# Altium project Beam_BMS_light.PrjPcb
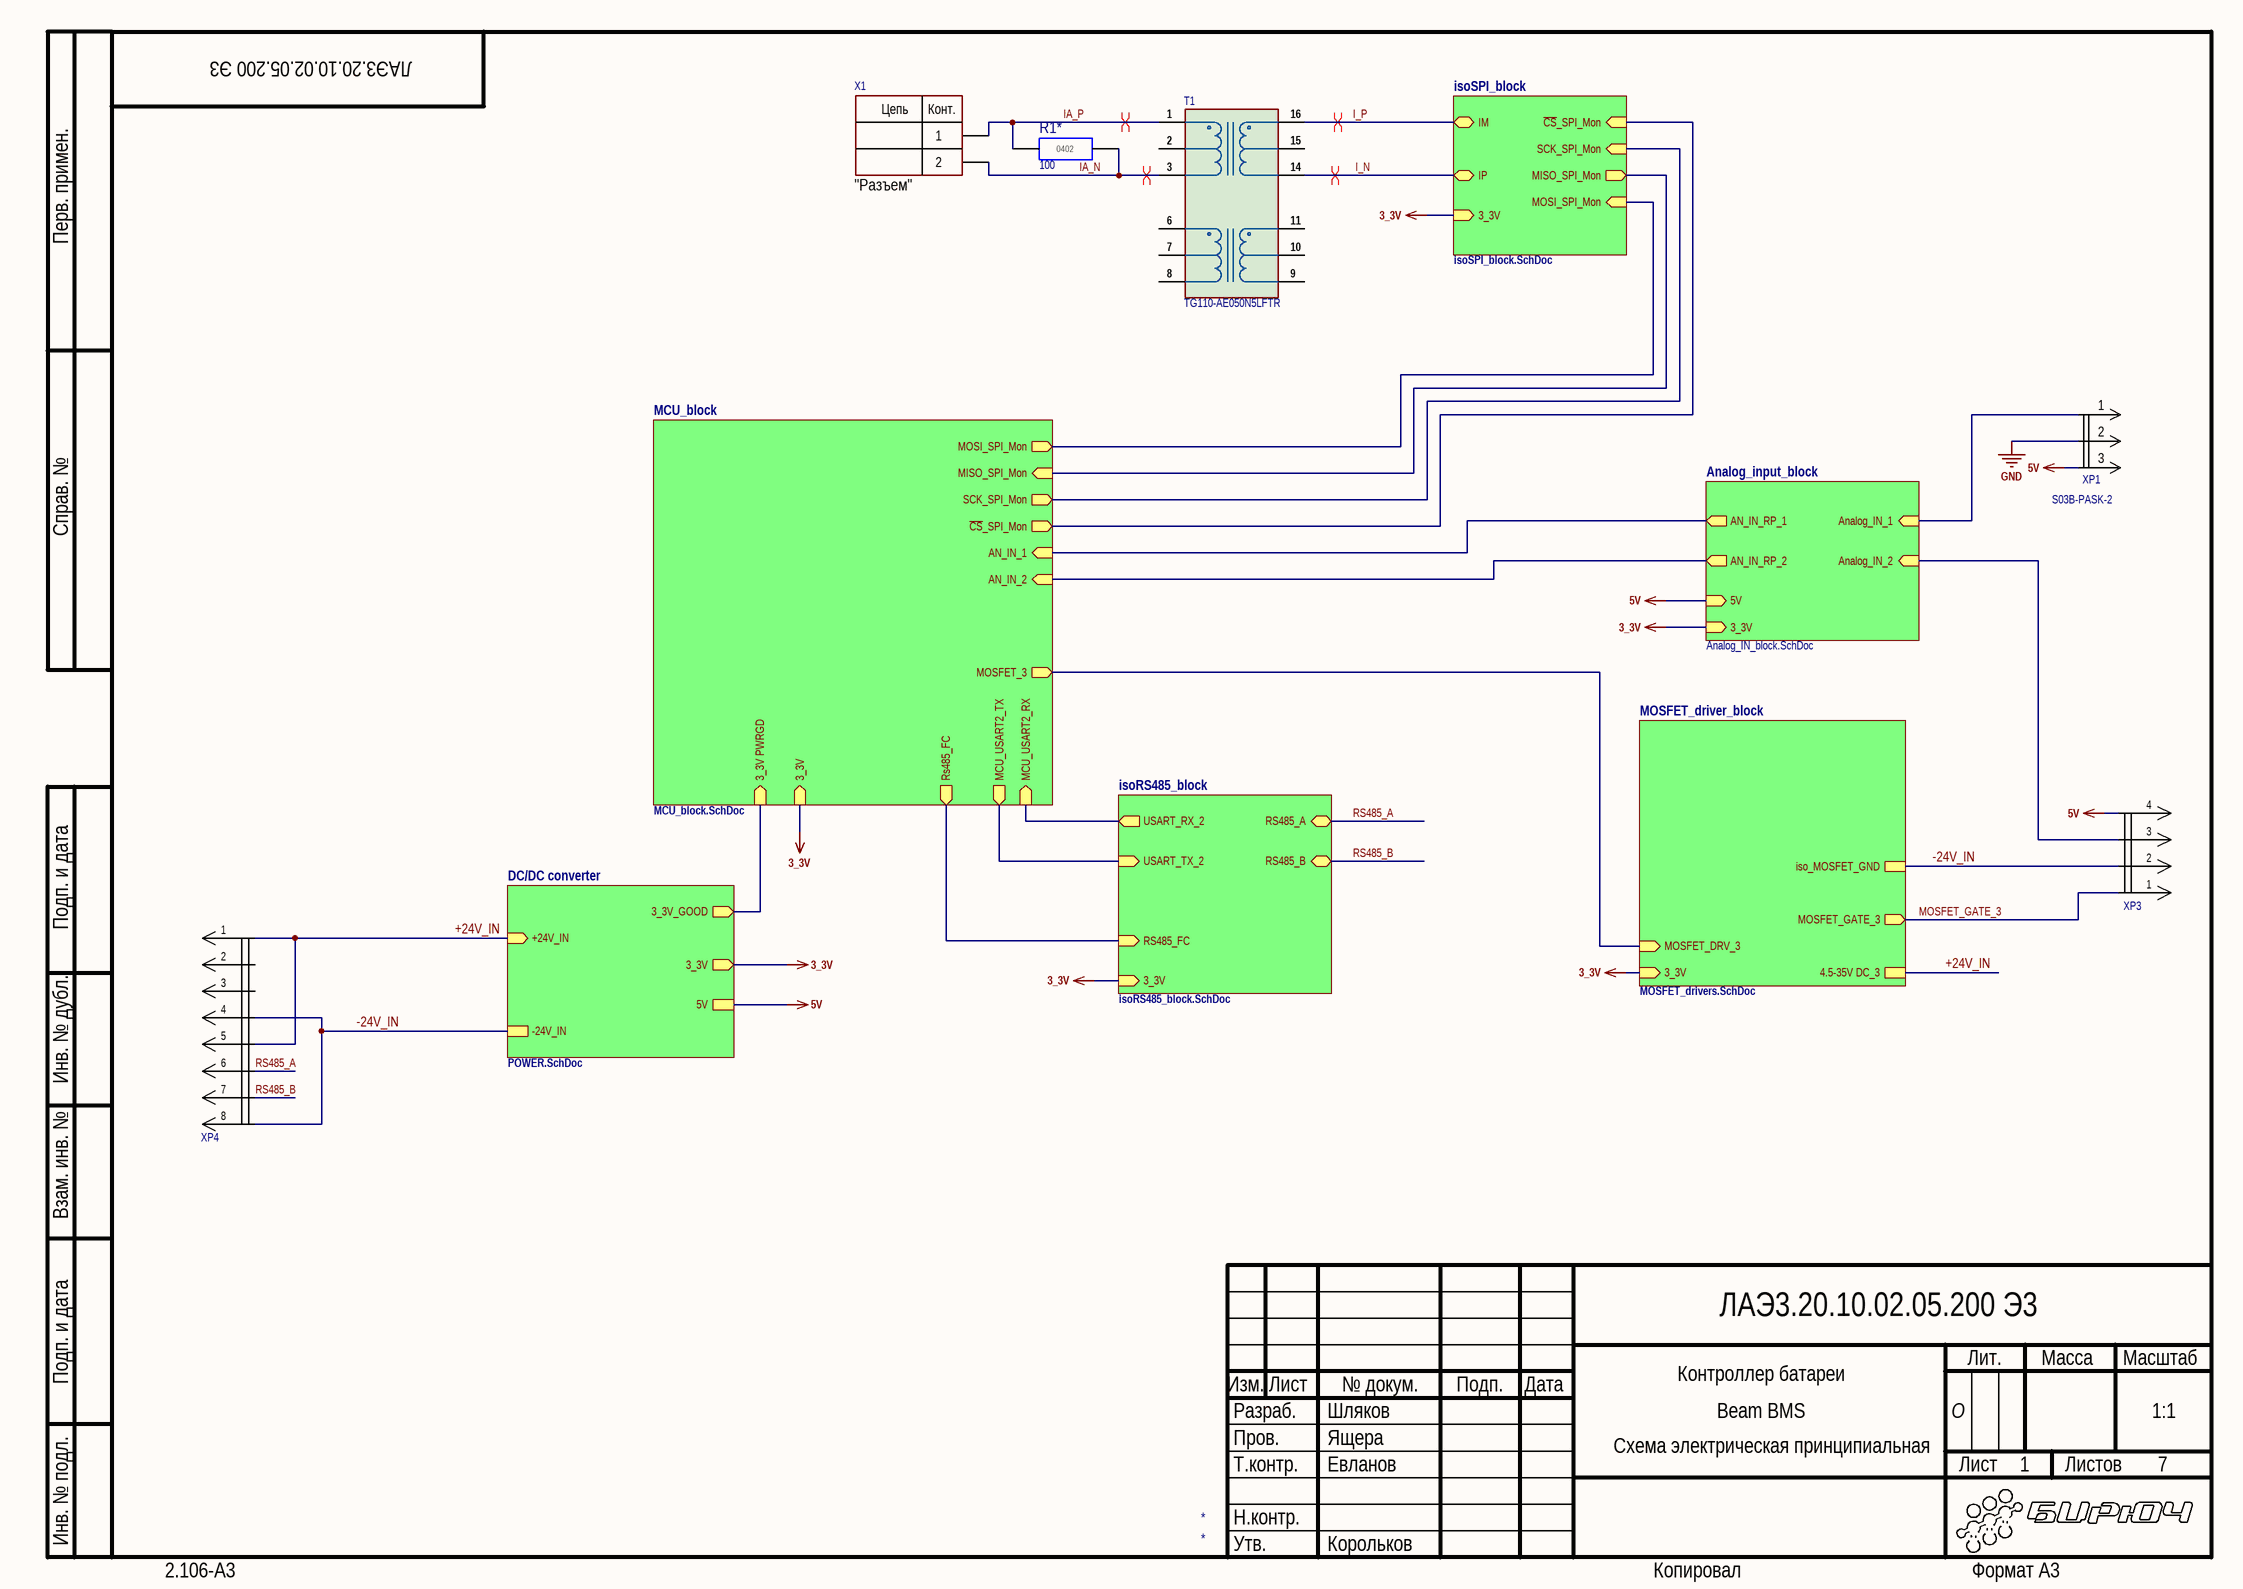
[diagram p0: Main.SchDoc]
7 sheets, 129 parts. Net scope: hierarchical (ports join the sheet entries above them; power ports are global).
Board file: Beam_BMS_light.PcbDoc
Sheets:
  Main.SchDoc
    isoSPI_block = isoSPI_block.SchDoc
    DC/DC converter = POWER.SchDoc
    MCU_block = MCU_block.SchDoc
    isoRS485_block = isoRS485_block.SchDoc
    MOSFET_driver_block = MOSFET_drivers.SchDoc
    Analog_input_block = Analog_IN_block.SchDoc

## Sheet Main.SchDoc: Контроллер батареи
size 420 x 297 mm; Date: 12.01.21; ApprovedBy: Корольков; CheckedBy: Ящера; Author: Шляков; DocumentNumber: ЛАЭ3.20.10.02.05.200 Э3; SheetNumber: 1; SheetTotal: 7; Letter1Column: O; Scale: 1:1; ProcessInspection: Евланов; Title2str: Beam BMS; DocumentType: Схема электрическая принципиальная

### Parts
R1*  value 100  [CR0402(1005)]  (hidden comment: CR0402-100-±5%)
T1  TG110-AE050N5LFTR  [SMT4_SOIC16_N5]
X1  CommentText: "Разъем"  [MOLEX 1053131102]
XP1  S03B-PASK-2  [S03B-PASK-2]
XP3  1565749-3  [TE_1565749-3]  (value not drawn)
XP4  1-1379684-1  [TE_1379684-1]  (value not drawn)

### Sub-sheets
Analog_input_block = Analog_IN_block.SchDoc: AN_IN_RP_2 (out), Analog_IN_2 (in), 3_3V (in), AN_IN_RP_1 (out), Analog_IN_1 (in), 5V (in)
DC/DC converter = POWER.SchDoc: 5V, 3_3V_GOOD (out), 3_3V (out), +24V_IN (in), -24V_IN
isoRS485_block = isoRS485_block.SchDoc: 3_3V (in), RS485_FC (in), RS485_B (bidir), RS485_A (bidir), USART_RX_2 (out), USART_TX_2 (in)
isoSPI_block = isoSPI_block.SchDoc: ~{CS}_SPI_Mon (in), IM (bidir), SCK_SPI_Mon (in), MISO_SPI_Mon (out), MOSI_SPI_Mon (in), 3_3V (in), IP (bidir)
MCU_block = MCU_block.SchDoc: SCK_SPI_Mon (out), 3_3V (in), MISO_SPI_Mon (in), ~{CS}_SPI_Mon (out), MOSI_SPI_Mon (out), MCU_USART2_TX (out), MCU_USART2_RX (in), MOSFET_3 (out), 3_3V PWRGD (in), AN_IN_1 (in), AN_IN_2 (in), Rs485_FC (out)
MOSFET_driver_block = MOSFET_drivers.SchDoc: MOSFET_GATE_3 (out), MOSFET_DRV_3 (in), 3_3V (in), iso_MOSFET_GND, 4.5-35V DC_3

### Nets
3_3V: sheet isoSPI_block/3_3V, sheet DC/DC converter/3_3V, sheet MCU_block/3_3V, sheet isoRS485_block/3_3V, sheet MOSFET_driver_block/3_3V, sheet Analog_input_block/3_3V
5V: XP1.3 XP3.4 ; sheet DC/DC converter/5V, sheet Analog_input_block/5V
GND: XP1.2
3_3V_GOOD: sheet DC/DC converter/3_3V_GOOD, sheet MCU_block/3_3V PWRGD
+24V_IN: XP4.1 XP4.5 ; sheet DC/DC converter/+24V_IN, sheet MOSFET_driver_block/4.5-35V DC_3
-24V_IN: XP3.2 XP4.4 XP4.8 ; sheet DC/DC converter/-24V_IN, sheet MOSFET_driver_block/iso_MOSFET_GND
AN_IN_1: sheet MCU_block/AN_IN_1, sheet Analog_input_block/AN_IN_RP_1
AN_IN_2: sheet MCU_block/AN_IN_2, sheet Analog_input_block/AN_IN_RP_2
Analog_IN_1: XP1.1 ; sheet Analog_input_block/Analog_IN_1
Analog_IN_2: XP3.3 ; sheet Analog_input_block/Analog_IN_2
~{CS}_SPI_Mon: sheet isoSPI_block/~{CS}_SPI_Mon, sheet MCU_block/~{CS}_SPI_Mon
I_N: T1.14(S1_P) ; sheet isoSPI_block/IP
I_P: T1.16(S1_N) ; sheet isoSPI_block/IM
IA_N: R1*.2(-) T1.3(P1_2) X1.2  [project net IA_N_1]
IA_P: R1*.1(+) T1.1(P1_1) X1.1  [project net IA_P_1]
MCU_USART2_RX: sheet MCU_block/MCU_USART2_RX, sheet isoRS485_block/USART_RX_2
MCU_USART2_TX: sheet MCU_block/MCU_USART2_TX, sheet isoRS485_block/USART_TX_2
MISO_SPI_Mon: sheet isoSPI_block/MISO_SPI_Mon, sheet MCU_block/MISO_SPI_Mon
MOSFET_3: sheet MCU_block/MOSFET_3, sheet MOSFET_driver_block/MOSFET_DRV_3
MOSFET_GATE_3: XP3.1 ; sheet MOSFET_driver_block/MOSFET_GATE_3
MOSI_SPI_Mon: sheet isoSPI_block/MOSI_SPI_Mon, sheet MCU_block/MOSI_SPI_Mon
RS485_A: XP4.6 ; sheet isoRS485_block/RS485_A
RS485_B: XP4.7 ; sheet isoRS485_block/RS485_B
RS485_FC: sheet MCU_block/Rs485_FC, sheet isoRS485_block/RS485_FC
SCK_SPI_Mon: sheet isoSPI_block/SCK_SPI_Mon, sheet MCU_block/SCK_SPI_Mon

Not connected (* = marked no-connect by the designer): T1 2(P1_T) 4(NC@1) 5(NC@2) 6(P2_1) 7(P2_T) 8(P2_2) 9(S2_P) 10(S2_T) 11(S2_N) 12(NC@4) 13(NC@3) 15(S1_T); XP4 2 3

### Layout directives
differential pair: I_N, I_P, IA_N_1, IA_P_1

### Notes on the sheet
- Перв. примен.
- Справ. №
- Подп. и дата
- Инв. № дубл.
- Взам. инв. №
- Разраб.
- Изм.
- Лист
- № докум.
- Подп.
- Дата
- Лит.
- Масса
- Масштаб
- Пров.
- Т.контр.
- Листов
- Инв. № подл.
- Утв.
- Н.контр.
- 2.106-A3
- Копировал
- Формат А3
- (in symbol CR0402-#-±5%) 0402
- (in symbol Molex 1053131102) Цепь; Конт.

### Library data of the parts
R1* = CR0402-#-±5%: Чип резистор; Maximum Working Voltage: 50 В; TOLERANCE: 5%; Supplier 1: Digi-Key; Supplier Part Number 1: 311-10.0KLRDKR-ND
T1 = TG110-AE050N5LFTR: Halo's <b>TG110-AE050N5LFTR</b> ULTRA-Series, 16 Pin SOIC 10/100BASE-TX Magnetic Modules<br> <br> <b>Description:</b><br> <br>; Package: None; Price: None; Value: *; Availability: Unavailable; Supplier 1: Mouser; Supplier Part Number 1: 493-TG110-AE050N5LF; MP: TG110-AE050N5LFTR
X1 = Molex 1053131102: Manufacturer: Molex; ValueManufacturerPartNumber: Connector, 2pin, 2.5mm, 1500VDC, 6.5A; TypeConnector: Connector; VoltageMax: 1500VDC; Pitch: 2.5mm; CurrentMax: 6.5A; Multichannel: 2pin; PartNumber: 1053131102
XP1 = S03B-PASK-2: Вилка угловая выводная, шаг 2мм; Manifacturing: JST; PN: JST S03B-PASK-2(LF)(SN); Supplier 1: Newark; Supplier Part Number 1: 90R9294
XP3 = TE-1565749-3: TH/.025 Connector System, Automotive Headers, 4 Position, 2.2mm [.087in] Centerline, Horizontal, 1 Row, Gray, Through Hole - Solder, Tin (Sn); Manufacturer: TE Connectivity; PartNumber: 1565749-3; Type: Automotive, for PCB; PCB Mount Orientation: Horizontal; Color: Gray; Temperature: -40...+100 C; Series: TH/.025
XP4 = TE-1379684-1: TH/.025 Connector System, Automotive Headers, 8 Position, 2.2mm [.087in] Centerline, Horizontal, 2 Row, Black, Through Hole - Solder, Tin (Sn); Manufacturer: TE Connectivity; PartNumber: 1-1379684-1; Type: Automotive, for PCB; PCB Mount Orientation: Horizontal; Color: Black!!!; Temperature: -40...+100 C; Series: TH/.025

## Sheet isoSPI_block.SchDoc
size 420 x 297 mm; DocumentNumber: ЛАЭ3.20.10.02.05.200 Э3; SheetNumber: 3
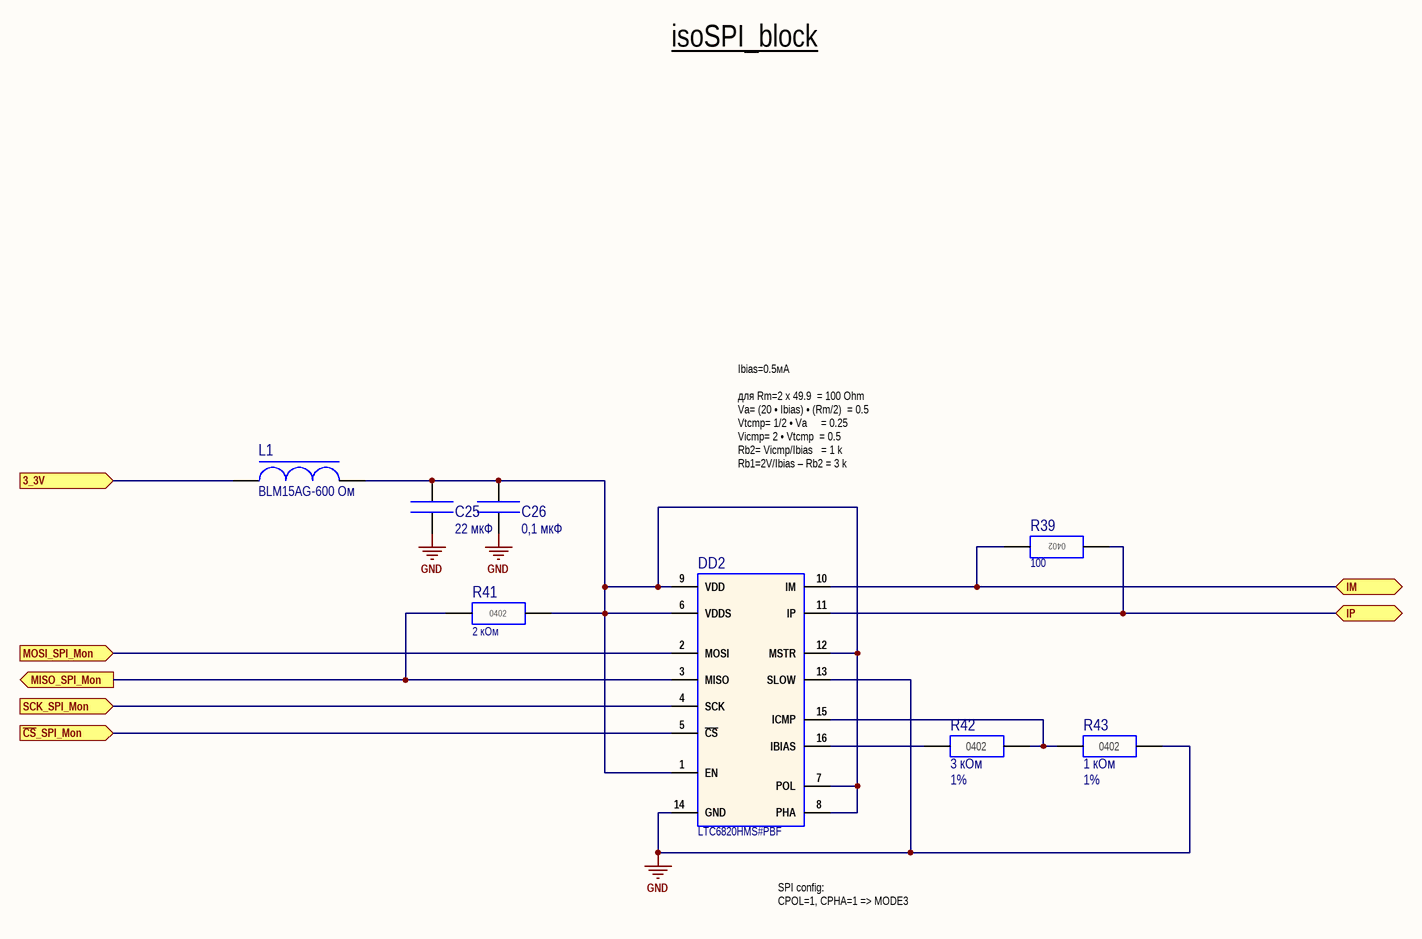
[diagram p1: isoSPI_block.SchDoc]

### Parts
C25  value 22 мкФ  [CC1206]  (hidden comment: CC1206-X7R-22 мкФ-20%-100В)
C26  value 0,1 мкФ  [CC0402(1005)]  (hidden comment: CC0402-X7R-0,1 мкФ-20%-50В)
DD2  LTC6820HMS#PBF  [MSOP-16_MS]
L1  BLM15AG-600 Ом  [CL0402(1005)]
R39  value 100  [CR0402(1005)]  (hidden comment: CR0402-100-±5%)
R41  value 2 кОм  [CR0402(1005)]  (hidden comment: CR0402-2 кОм-±5%)
R42  value 3 кОм  TOLERANCE: 1%  [CR0402(1005)]  (hidden comment: CR0402-3 кОм-±1%)
R43  value 1 кОм  TOLERANCE: 1%  [CR0402(1005)]  (hidden comment: CR0402-1 кОм-±1%)

### Ports
3_3V (in), IM (bidir), IP (bidir), MISO_SPI_Mon (out), MOSI_SPI_Mon (in), SCK_SPI_Mon (in), ~{CS}_SPI_Mon (in)

### Nets
3_3V: L1.1 ; port 3_3V
GND: C25.2(-) C26.2(-) DD2.13(SLOW) DD2.14(GND) R43.2(-)
~{CS}_SPI_Mon: DD2.5(~{CS}) ; port ~{CS}_SPI_Mon
I_N: DD2.11(IP) R39.1(+) ; port IP
I_P: DD2.10(IM) R39.2(-) ; port IM
MISO_SPI_Mon: DD2.3(MISO) R41.1(+) ; port MISO_SPI_Mon
MOSI_SPI_Mon: DD2.2(MOSI) ; port MOSI_SPI_Mon
SCK_SPI_Mon: DD2.4(SCK) ; port SCK_SPI_Mon
NetC25_1: C25.1(+) C26.1(+) DD2.1(EN) DD2.6(VDDS) DD2.7(POL) DD2.8(PHA) DD2.9(VDD) DD2.12(MSTR) L1.2 R41.2(-)
NetDD2_15: DD2.15(ICMP) R42.2(-) R43.1(+)
NetDD2_16: DD2.16(IBIAS) R42.1(+)

### Notes on the sheet
- isoSPI_block
- Ibias=0.5мА
  для Rm=2 x 49.9		= 100 Ohm
  Va= (20 • Ibias) • (Rm/2)  = 0.5
  Vtcmp= 1/2 • Va    	= 0.25
  Vicmp= 2 • Vtcmp		= 0.5
  Rb2= Vicmp/Ibias 		= 1 k
  Rb1=2V/Ibias – Rb2	= 3 k
- SPI config:
  CPOL=1, CPHA=1 => MODE3
- Подп. и дата
- Инв. № дубл.
- Взам. инв. №
- Инв. № подл.
- Изм.
- Лист
- № докум.
- Подп.
- Дата
- 2.106-A3
- Копировал
- Формат А3
- (in symbol CR0402-#-±1%) 0402
- (in symbol CR0402-#-±5%) 0402

### Library data of the parts
C25 = CC1206-X7R-#-20%-100В: Чип конденсатор керамический
C26 = CC0402-X7R-#-20%-50В: Чип конденсатор керамический; Supplier 1: Digi-Key; Supplier Part Number 1: 399-3066-1-ND
DD2 = LTC6820HMS#PBF: isoSPI Isolated Communications Interface; Vendor: Linear Technology; Manufacturer_Part_Number: ltc6820hms#pbf; Value: Value; Type: Type; RefDes: RefDes; DesignItemID: *; ComponentLink1Description: Datasheet; ComponentLink1URL: https://www.analog.com/media/en/technical-documentation/data-sheets/LTC6820.pdf
L1 = BLM15: Чип индуктивность подавления EMP; VALUE: 600 Ом; Компэл: BLM15AG601SN1D; Supplier 1: Farnell; Supplier Part Number 1: 1515762
R39 R41 = CR0402-#-±5%: as R1* on sheet Main; Supplier 1: Digi-Key; Supplier Part Number 1: 311-10.0KLRDKR-ND
R42 R43 = CR0402-#-±1%: Чип резистор; Maximum Working Voltage: 50 В; Supplier 1: Digi-Key; Supplier Part Number 1: 311-10.0KLRDKR-ND

## Sheet POWER.SchDoc
size 420 x 297 mm; DocumentNumber: ЛАЭ3.20.10.02.05.200 Э3; SheetNumber: 4
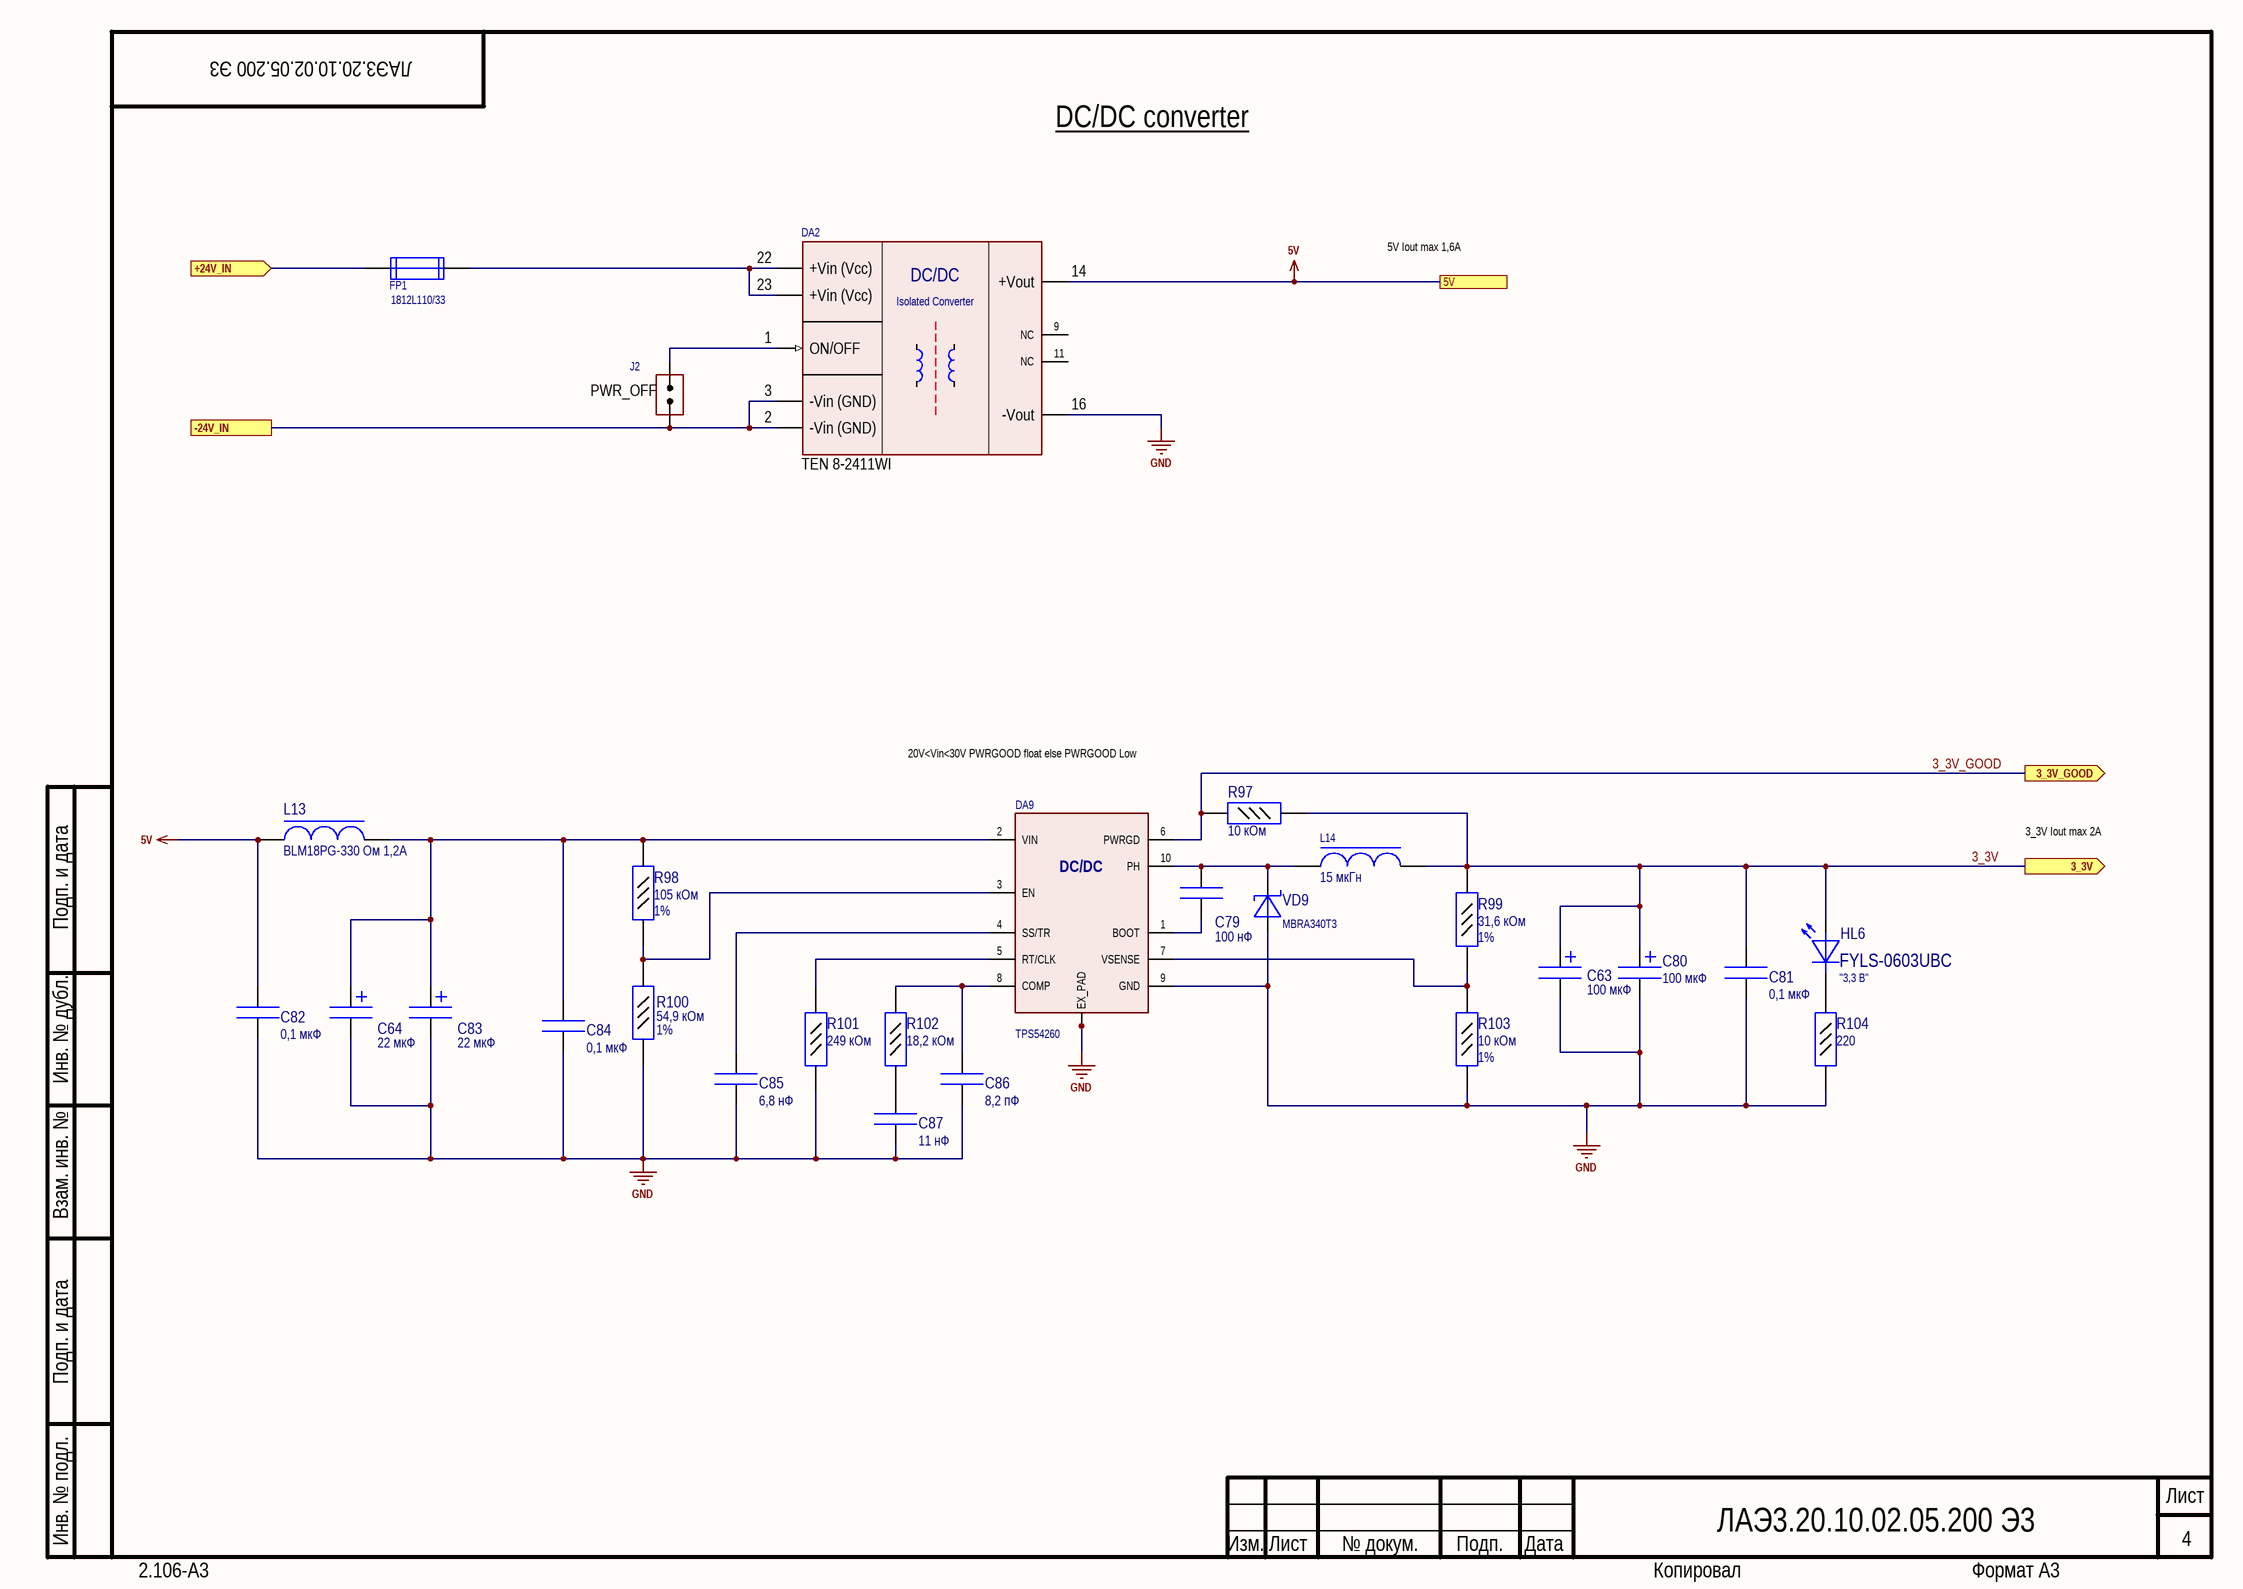
[diagram p2: POWER.SchDoc]

### Parts
C63  value 100 мкФ  [CA-D (6.3x5.4)(0605)]  (hidden comment: CA-16V100 мкФ-±20%-D (0605))
C64  value 22 мкФ  [CT-D]  (hidden comment: CT-35V-22uF-±20%-D)
C79  value 100 нФ  [CC0603]  (hidden comment: CC0603-X7R-100 нФ-20%-50В)
C80  value 100 мкФ  [CA-D (6.3x5.4)(0605)]  (hidden comment: CA-16V100 мкФ-±20%-D (0605))
C81  value 0,1 мкФ  [CC0603]  (hidden comment: CC0603-X7R-0,1 мкФ-20%-50В)
C82  value 0,1 мкФ  [CC0603]  (hidden comment: CC0603-X7R-0,1 мкФ-20%-50В)
C83  value 22 мкФ  [CT-D]  (hidden comment: CT-35V-22uF-±20%-D)
C84  value 0,1 мкФ  [CC0603]  (hidden comment: CC0603-X7R-0,1 мкФ-20%-50В)
C85  value 6,8 нФ  [CC0603]  (hidden comment: CC0603-X7R-6,8 нФ-20%-50В)
C86  value 8,2 пФ  [CC0603]  (hidden comment: CC0603-X7R-8,2 пФ-20%-50В)
C87  value 11 нФ  [CC0603]  (hidden comment: CC0603-X7R-11 нФ-20%-50В)
DA2  TEN 8-2411WI  [TEN_8-2411WI]
DA9  TPS54260  [IC_XTR111AIDGQR]
FP1  1812L110/33  [MF-MSMD010]
HL6  FYLS-0603UBC  Mean: "3,3 В"  [LED0603_Blue]
J2  CommentText: PWR_OFF  [CON: PLS-2]
L13  BLM18PG-330 Ом 1,2A  [CL0603]
L14  value 15 мкГн  [SRR0603]  (hidden comment: SRR0603-150ML)
R97  value 10 кОм  [CR0603]  (hidden comment: CR0603-10 кОм-±5%)
R98  value 105 кОм  TOLERANCE: 1%  [CR0603]  (hidden comment: CR0603-105 кОм-±1%)
R99  value 31,6 кОм  TOLERANCE: 1%  [CR0603]  (hidden comment: CR0603-31,6 кОм-±1%)
R100  value 54,9 кОм  TOLERANCE: 1%  [CR0603]  (hidden comment: CR0603-54,9 кОм-±1%)
R101  value 249 кОм  [CR0603]  (hidden comment: CR0603-249 кОм-±5%)
R102  value 18,2 кОм  [CR0603]  (hidden comment: CR0603-18,2 кОм-±5%)
R103  value 10 кОм  TOLERANCE: 1%  [CR0603]  (hidden comment: CR0603-10 кОм-±1%)
R104  value 220  [CR0603]  (hidden comment: CR0603-220-±5%)
VD9  MBRA340T3  [DO-214AC (SMA)]

### Ports
3_3V (out), 3_3V_GOOD (out), 5V, +24V_IN (in), -24V_IN

### Nets
3_3V: C63.1(+) C80.1(+) C81.1(+) HL6.1(A) L14.2 R97.1(+) R99.2(-) ; port 3_3V
5V: C82.1(+) DA2.14(+Vout) L13.1 ; port 5V
GND: C63.2(-) C64.2(-) C80.2(-) C81.2(-) C82.2(-) C83.2(-) C84.2(-) C85.2(-) C86.2(-) C87.2(-) DA2.16(-Vout) DA9.9(GND) DA9.11(EX_PAD) DA9.12(EX_PAD) DA9.13(EX_PAD) DA9.14(EX_PAD) DA9.15(EX_PAD) DA9.16(EX_PAD) R100.1(+) R101.1(+) R103.1(+) R104.2(-) VD9.1(+)
3_3V_GOOD: DA9.6(PWRGD) R97.2(-) ; port 3_3V_GOOD
+24V_IN: FP1.1(+) ; port +24V_IN
-24V_IN: DA2.2(-Vin_(GND)) DA2.3(-Vin_(GND)) J2.2(IN) ; port -24V_IN
NetC64_1: C64.1(+) C83.1(+) C84.1(+) DA9.2(VIN) L13.2 R98.2(-)
NetC79_1: C79.1(+) DA9.10(PH) L14.1 VD9.2(-)
NetC79_2: C79.2(-) DA9.1(BOOT)
NetC85_1: C85.1(+) DA9.4(SS/TR)
NetC86_1: C86.1(+) DA9.8(COMP) R102.2(-)
NetC87_1: C87.1(+) R102.1(+)
NetDA2_1: DA2.1(ON/OFF) J2.1(IN)
NetDA2_22: DA2.22(+Vin_(Vcc)) DA2.23(+Vin_(Vcc)) FP1.2(-)
NetDA9_3: DA9.3(EN) R98.1(+) R100.2(-)
NetDA9_5: DA9.5(RT/CLK) R101.2(-)
NetDA9_7: DA9.7(VSENSE) R99.1(+) R103.2(-)
NetHL6_2: HL6.2(K) R104.1(+)

Not connected (* = marked no-connect by the designer): DA2 9(NC) 11(NC)

### Notes on the sheet
- DC/DC converter
- 5V Iout max 1,6A
- 20V<Vin<30V PWRGOOD float else PWRGOOD Low
- 3_3V Iout max 2A
- Подп. и дата
- Инв. № дубл.
- Взам. инв. №
- Инв. № подл.
- Изм.
- Лист
- № докум.
- Подп.
- Дата
- 2.106-A3
- Копировал
- Формат А3
- (in symbol TEN 8-2411WI) DC/DC; Isolated Converter
- (in symbol TPS54260DGQ) DC/DC

### Library data of the parts
C63 C80 = CA-16V-#-±20%-D (0605): SMD ELECTROLYTIC CAPACITORS; КОМПЭЛ: CA016M0100RED-0605; Supplier 1: Mouser; Supplier Part Number 1: N/A; Supplier 2: Farnell; Supplier Part Number 2: 2370253
C64 C83 = CT-35V-#-±20%-D: Чип конденсатор  танталовый
C79 C81 C82 C84-C87 = CC0603-X7R-#-20%-50В: Чип конденсатор керамический; Компэл: CC0603KRX7R9BB104; Supplier 1: Newark; Supplier Part Number 1: 65R8251
DA2 = TEN 8-2411WI: 9-36V input, 5V, 1.6 A output, 8 Watt dc/dc converter isolated 1500 VDC; Manufacturer: TRACO POWER; ValueManufacturerPartNumber: DC/DC converter, input 9...36V, 300 kHz, 5 V 1%, 1600 mA, -40...+85°C, metall DIP-24; VoltageInput: input 9...36V; Frequency: 300 kHz; CurrentOutput: 1600 mA; VoltageOutput: 5 V 1%; Package: metall DIP-24; ComponentType: DC/DC converter; Temperature: -40...+85°C; Supplier 1: RSComponents; Supplier Part Number 1: 1247572; Isolation: 1500 VDC; PartNumber: TEN 8-2411WI
DA9 = TPS54260DGQ: 60-V,2.5-A,step-down regulator with an integrated high-side MOSFET; ComponentLink1Description: Datasheet; ComponentLink1URL: https://www.ti.com/lit/ds/symlink/tps54262-ep.pdf?ts=1608308143821&ref_url=https%253A%252F%252Fwww.ti.com%252Fpower-management%252Fnon-isolated-dc-dc-switching-regulators%252Fstep-down-buck%252Fbuck-converter-integrated-switch%252Fproducts.html; Supplier 1: Digi-Key; Supplier Part Number 1: 296-27231-5-ND; _Value: TPS54260
FP1 = MF-MSMD010: сраб. 1,1 А, крит.1,95А
HL6 = FYLS-0603UBC: Светодиод синий SMD0603
J2 = Jumper_single
L13 = BLM18: Чип индуктивность подавления EMP; VALUE: 330 Ом; Imax: 1,2A; Supplier 1: Mouser; Supplier Part Number 1: 81-BLM18PG331SN1D
L14 = SRR0603: Чип индуктивность 15 мкГн, 900 мА, Экранированный, 1.2 А
R97 R101 R102 R104 = CR0603-#-±5%: Чип резистор
R98-R100 R103 = CR0603-#-±1%: Чип резистор; Supplier 1: Farnell; Supplier Part Number 1: 2008332
VD9 = MBRA340T3: Диод шотки I=3А V=40В; PR: ON Semiconductor; Supplier 1: Digi-Key; Supplier Part Number 1: MBRA340T3GOSDKR-ND

## Sheet MCU_block.SchDoc
size 420 x 297 mm; DocumentNumber: ЛАЭ3.20.10.02.05.200 Э3; SheetNumber: 2
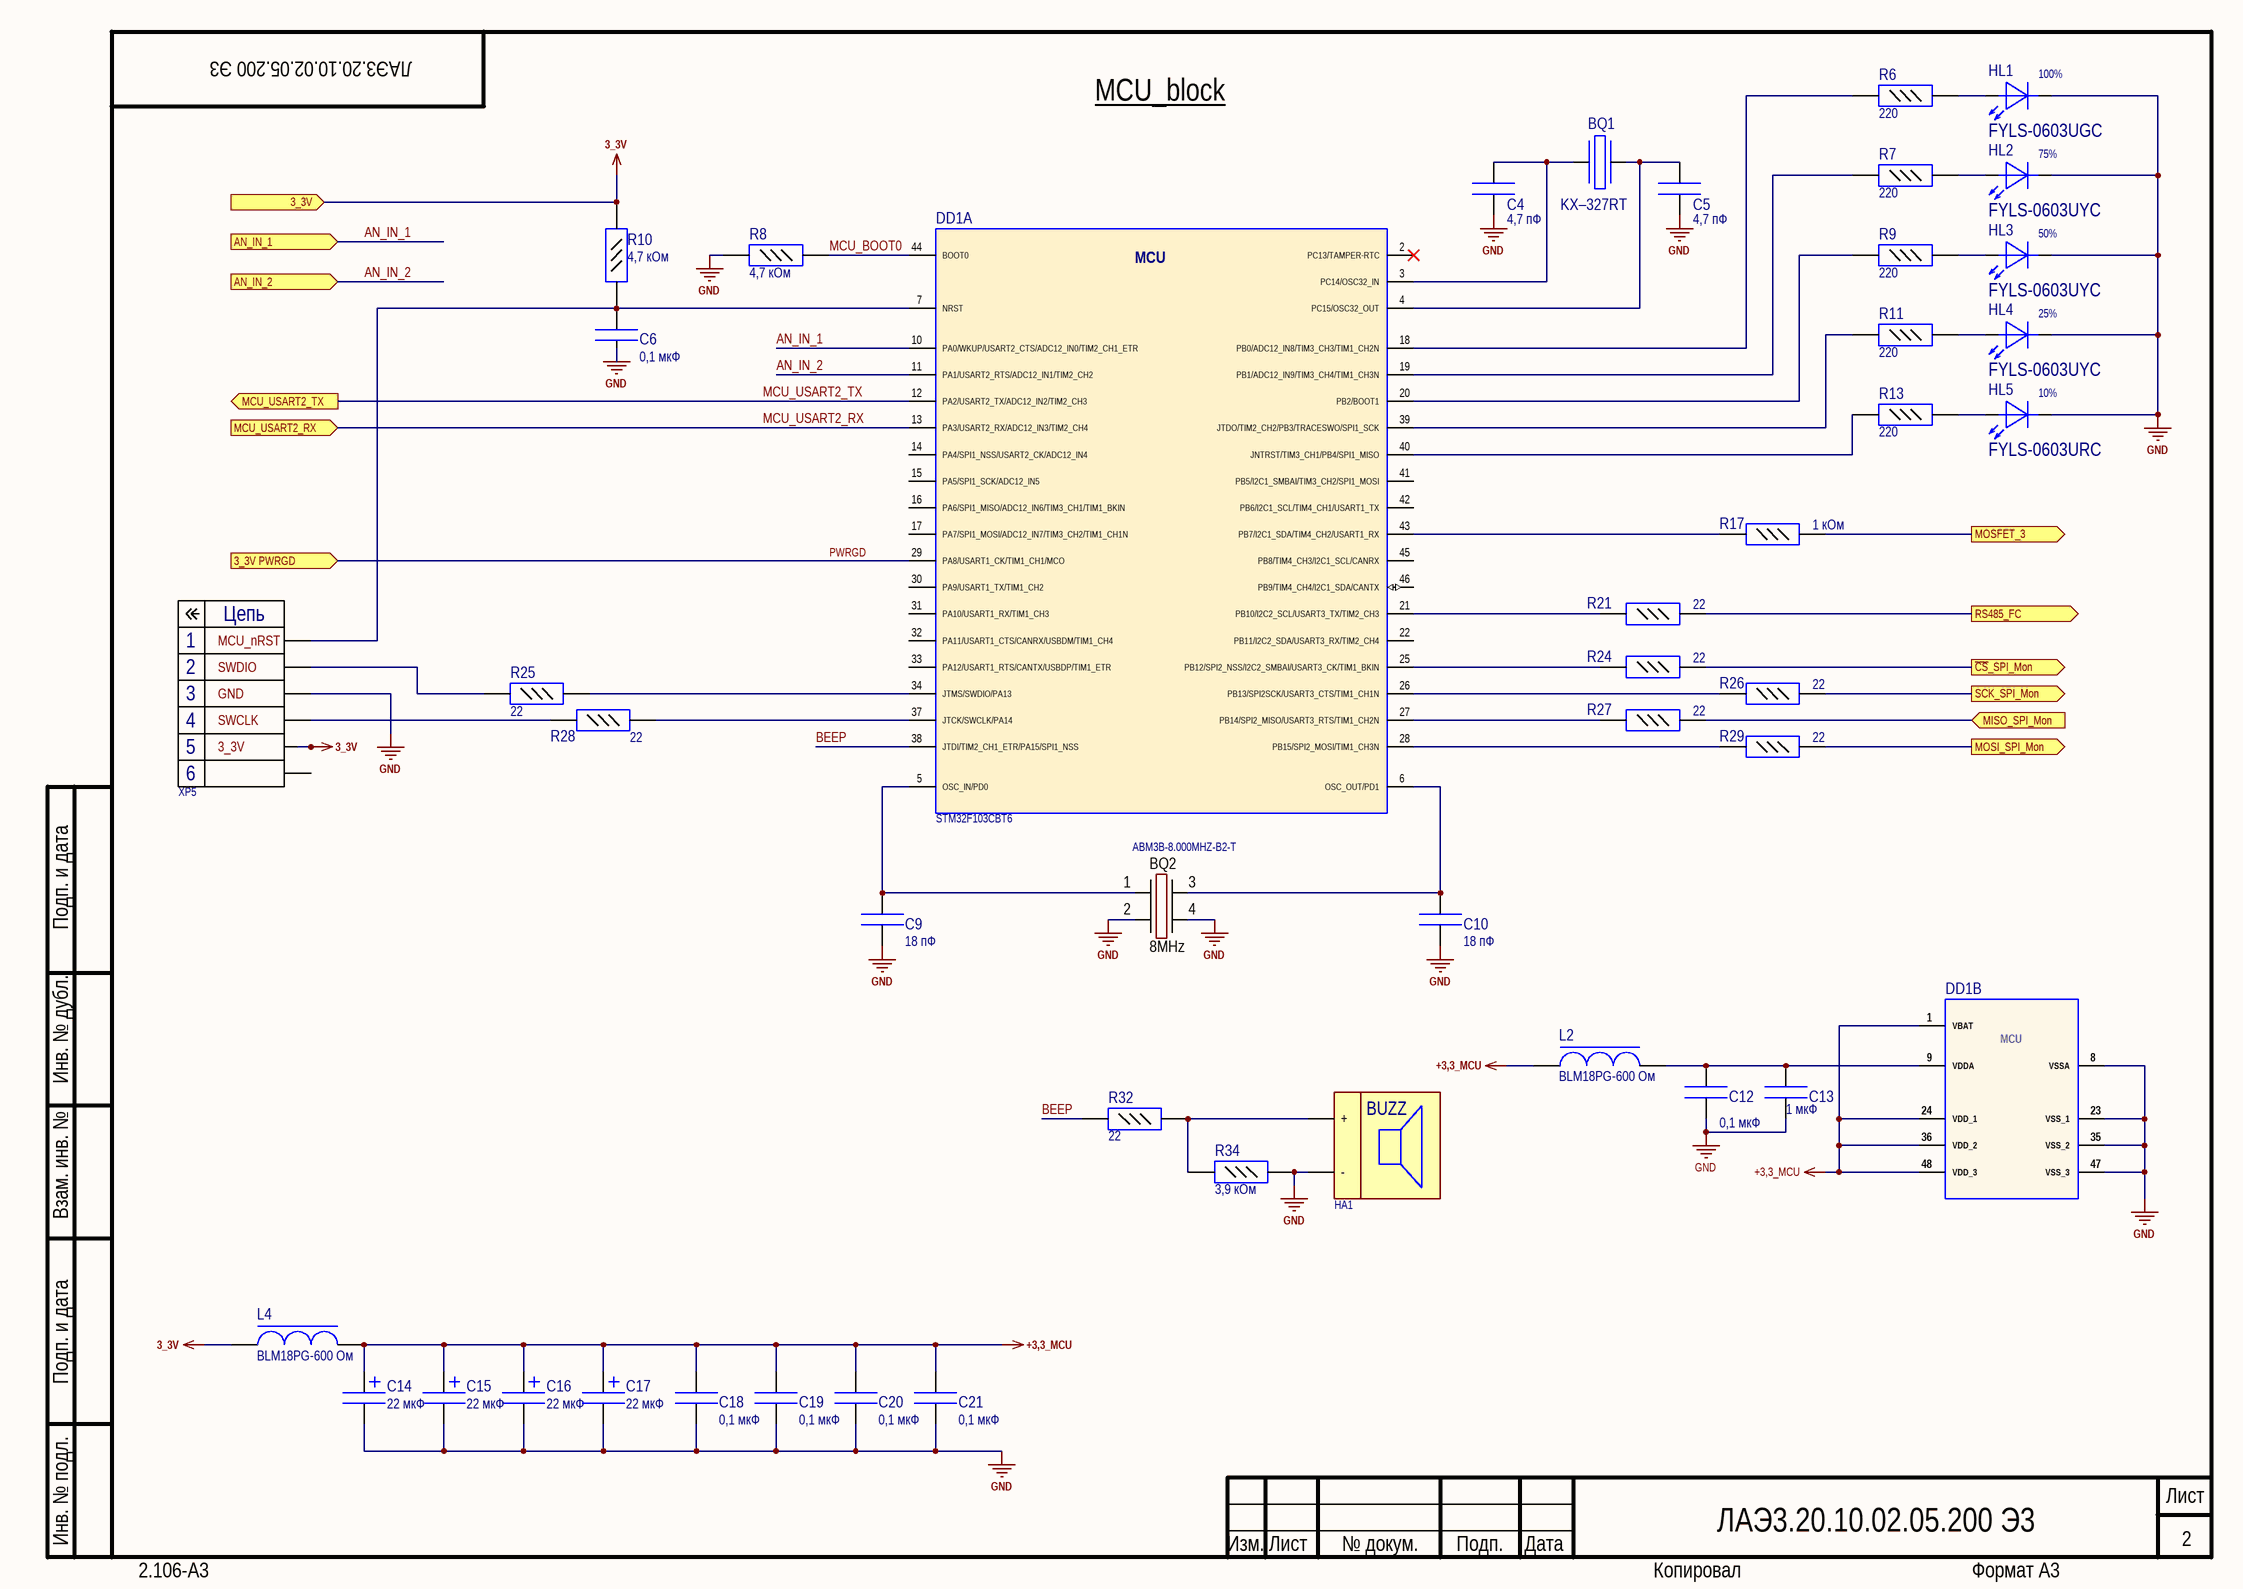
[diagram p3: MCU_block.SchDoc]

### Parts
BQ1  KX–327RT  [KX–327RT]
BQ2  Frequency: 8MHz  [OSC: 5032]  (hidden comment: ABM3B-8.000MHZ-B2-T)
C4  value 4,7 пФ  [CC0603]  (hidden comment: CC0603-X5R-4,7 пФ-20%-10В)
C5  value 4,7 пФ  [CC0603]  (hidden comment: CC0603-X5R-4,7 пФ-20%-10В)
C6  value 0,1 мкФ  [CC0603]  (hidden comment: CC0603-X5R-0,1 мкФ-20%-10В)
C9  value 18 пФ  [CC0603]  (hidden comment: CC0603-X5R-18 пФ-20%-10В)
C10  value 18 пФ  [CC0603]  (hidden comment: CC0603-X5R-18 пФ-20%-10В)
C12  value 0,1 мкФ  [CC0603]  (hidden comment: CC0603-X5R-0,1 мкФ-20%-10В)
C13  value 1 мкФ  [CC0603]  (hidden comment: CC0603-X5R-1 мкФ-20%-10В)
C14  value 22 мкФ  [CT-C]  (hidden comment: CT-10V-22uF-±20%-C)
C15  value 22 мкФ  [CT-C]  (hidden comment: CT-10V-22uF-±20%-C)
C16  value 22 мкФ  [CT-C]  (hidden comment: CT-10V-22uF-±20%-C)
C17  value 22 мкФ  [CT-C]  (hidden comment: CT-10V-22uF-±20%-C)
C18  value 0,1 мкФ  [CC0603]  (hidden comment: CC0603-X5R-0,1 мкФ-20%-10В)
C19  value 0,1 мкФ  [CC0603]  (hidden comment: CC0603-X5R-0,1 мкФ-20%-10В)
C20  value 0,1 мкФ  [CC0603]  (hidden comment: CC0603-X5R-0,1 мкФ-20%-10В)
C21  value 0,1 мкФ  [CC0603]  (hidden comment: CC0603-X5R-0,1 мкФ-20%-10В)
DD1  STM32F103CBT6  [LQFP50P700x700-48]  (parts A,B of 2)
HA1  HCM1203X  [HCM12X]  (value not drawn)
HL1  FYLS-0603UGC  mean: 100%  [LED0603_GREEN]
HL2  FYLS-0603UYC  mean: 75%  [LED0603_Yellow]
HL3  FYLS-0603UYC  mean: 50%  [LED0603_Yellow]
HL4  FYLS-0603UYC  mean: 25%  [LED0603_Yellow]
HL5  FYLS-0603URC  mean: 10%  [LED0603_Red]
L2  BLM18PG-600 Ом  [CL0603]
L4  BLM18PG-600 Ом  [CL0603]
R6  value 220  [CR0603]  (hidden comment: CR0603-220-±5%)
R7  value 220  [CR0603]  (hidden comment: CR0603-220-±5%)
R8  value 4,7 кОм  [CR0603]  (hidden comment: CR0603-4,7 кОм-±5%)
R9  value 220  [CR0603]  (hidden comment: CR0603-220-±5%)
R10  value 4,7 кОм  [CR0603]  (hidden comment: CR0603-4,7 кОм-±5%)
R11  value 220  [CR0603]  (hidden comment: CR0603-220-±5%)
R13  value 220  [CR0603]  (hidden comment: CR0603-220-±5%)
R17  value 1 кОм  [CR0603]  (hidden comment: CR0603-1 кОм-±5%)
R21  value 22  [CR0603]  (hidden comment: CR0603-22-±5%)
R24  value 22  [CR0603]  (hidden comment: CR0603-22-±5%)
R25  value 22  [CR0603]  (hidden comment: CR0603-22-±5%)
R26  value 22  [CR0603]  (hidden comment: CR0603-22-±5%)
R27  value 22  [CR0603]  (hidden comment: CR0603-22-±5%)
R28  value 22  [CR0603]  (hidden comment: CR0603-22-±5%)
R29  value 22  [CR0603]  (hidden comment: CR0603-22-±5%)
R32  value 22  [CR0603]  (hidden comment: CR0603-22-±5%)
R34  value 3,9 кОм  [CR0603]  (hidden comment: CR0603-3,9 кОм-±5%)
XP5  DS1022-1x6R  [PLS-6R]  (value not drawn)

### Ports
3_3V (in), 3_3V PWRGD (in), AN_IN_1 (in), AN_IN_2 (in), MCU_USART2_RX (in), MCU_USART2_TX (out), MISO_SPI_Mon (in), MOSFET_3 (out), MOSI_SPI_Mon (out), RS485_FC (out), SCK_SPI_Mon (out), ~{CS}_SPI_Mon (out)

### Nets
3_3V: L4.1 R10.2(-) XP5.5 ; port 3_3V
+3,3_MCU: C14.1(+) C15.1(+) C16.1(+) C17.1(+) C18.1(+) C19.1(+) C20.1(+) C21.1(+) DD1.1(VBAT) DD1.24(VDD_1) DD1.36(VDD_2) DD1.48(VDD_3) L2.1 L4.2
GND: BQ2.2 BQ2.4 C4.2(-) C5.2(-) C6.2(-) C9.2(-) C10.2(-) C12.2(-) C13.2(-) C14.2(-) C15.2(-) C16.2(-) C17.2(-) C18.2(-) C19.2(-) C20.2(-) C21.2(-) DD1.8(VSSA) DD1.23(VSS_1) DD1.35(VSS_2) DD1.47(VSS_3) HA1.2(-) HL1.2(K) HL2.2(K) HL3.2(K) HL4.2(K) HL5.2(K) R8.2(-) R34.1(+) XP5.3
AN_IN_1: DD1.10(PA0/WKUP/USART2_CTS/ADC12_IN0/TIM2_CH1_ETR) ; port AN_IN_1
AN_IN_2: DD1.11(PA1/USART2_RTS/ADC12_IN1/TIM2_CH2) ; port AN_IN_2
BEEP: DD1.38(JTDI/TIM2_CH1_ETR/PA15/SPI1_NSS) R32.1(+)  [project net BEEP_2]
~{CS}_SPI_Mon: R24.2(-) ; port ~{CS}_SPI_Mon
MCU_BOOT0: DD1.44(BOOT0) R8.1(+)  [project net MCU_BOOT0_2]
MCU_USART2_RX: DD1.13(PA3/USART2_RX/ADC12_IN3/TIM2_CH4) ; port MCU_USART2_RX
MCU_USART2_TX: DD1.12(PA2/USART2_TX/ADC12_IN2/TIM2_CH3) ; port MCU_USART2_TX
MISO_SPI_Mon: R27.2(-) ; port MISO_SPI_Mon
MOSFET_3: R17.2(-) ; port MOSFET_3
MOSI_SPI_Mon: R29.2(-) ; port MOSI_SPI_Mon
PWRGD: DD1.29(PA8/USART1_CK/TIM1_CH1/MCO) ; port 3_3V PWRGD  [project net 3_3V_GOOD]
RS485_FC: R21.2(-) ; port RS485_FC
SCK_SPI_Mon: R26.2(-) ; port SCK_SPI_Mon
NetBQ1_1: BQ1.1 C4.1(+) DD1.3(PC14/OSC32_IN)
NetBQ1_2: BQ1.2 C5.1(+) DD1.4(PC15/OSC32_OUT)
NetBQ2_1: BQ2.1 C9.1(+) DD1.5(OSC_IN/PD0)
NetBQ2_3: BQ2.3 C10.1(+) DD1.6(OSC_OUT/PD1)
NetC6_1: C6.1(+) DD1.7(NRST) R10.1(+) XP5.1
NetC12_1: C12.1(+) C13.1(+) DD1.9(VDDA) L2.2
NetDD1_18: DD1.18(PB0/ADC12_IN8/TIM3_CH3/TIM1_CH2N) R6.1(+)
NetDD1_19: DD1.19(PB1/ADC12_IN9/TIM3_CH4/TIM1_CH3N) R7.1(+)
NetDD1_20: DD1.20(PB2/BOOT1) R9.1(+)
NetDD1_21: DD1.21(PB10/I2C2_SCL/USART3_TX/TIM2_CH3) R21.1(+)
NetDD1_25: DD1.25(PB12/SPI2_NSS/I2C2_SMBAI/USART3_CK/TIM1_BKIN) R24.1(+)
NetDD1_26: DD1.26(PB13/SPI2SCK/USART3_CTS/TIM1_CH1N) R26.1(+)
NetDD1_27: DD1.27(PB14/SPI2_MISO/USART3_RTS/TIM1_CH2N) R27.1(+)
NetDD1_28: DD1.28(PB15/SPI2_MOSI/TIM1_CH3N) R29.1(+)
NetDD1_34: DD1.34(JTMS/SWDIO/PA13) R25.2(-)
NetDD1_37: DD1.37(JTCK/SWCLK/PA14) R28.2(-)
NetDD1_39: DD1.39(JTDO/TIM2_CH2/PB3/TRACESWO/SPI1_SCK) R11.1(+)
NetDD1_40: DD1.40(JNTRST/TIM3_CH1/PB4/SPI1_MISO) R13.1(+)
NetDD1_43: DD1.43(PB7/I2C1_SDA/TIM4_CH2/USART1_RX) R17.1(+)
NetHA1_1: HA1.1(+) R32.2(-) R34.2(-)
NetHL1_1: HL1.1(A) R6.2(-)
NetHL2_1: HL2.1(A) R7.2(-)
NetHL3_1: HL3.1(A) R9.2(-)
NetHL4_1: HL4.1(A) R11.2(-)
NetHL5_1: HL5.1(A) R13.2(-)
NetR25_1: R25.1(+) XP5.2
NetR28_1: R28.1(+) XP5.4

Not connected (* = marked no-connect by the designer): DD1 2(PC13/TAMPER-RTC)* 14(PA4/SPI1_NSS/USART2_CK/ADC12_IN4) 15(PA5/SPI1_SCK/ADC12_IN5) 16(PA6/SPI1_MISO/ADC12_IN6/TIM3_CH1/TIM1_BKIN) 17(PA7/SPI1_MOSI/ADC12_IN7/TIM3_CH2/TIM1_CH1N) 22(PB11/I2C2_SDA/USART3_RX/TIM2_CH4) 30(PA9/USART1_TX/TIM1_CH2) 31(PA10/USART1_RX/TIM1_CH3) 32(PA11/USART1_CTS/CANRX/USBDM/TIM1_CH4) 33(PA12/USART1_RTS/CANTX/USBDP/TIM1_ETR) 41(PB5/I2C1_SMBAI/TIM3_CH2/SPI1_MOSI) 42(PB6/I2C1_SCL/TIM4_CH1/USART1_TX) 45(PB8/TIM4_CH3/I2C1_SCL/CANRX) 46(PB9/TIM4_CH4/I2C1_SDA/CANTX); XP5 6

### Notes on the sheet
- MCU_block
- Labels drawn without touching a wire or pin: 3_3V, GND, MCU_nRST, SWCLK, SWDIO
- Подп. и дата
- Инв. № дубл.
- Взам. инв. №
- Инв. № подл.
- Изм.
- Лист
- № докум.
- Подп.
- Дата
- 2.106-A3
- Копировал
- Формат А3
- (in symbol HCM1203X) BUZZ
- (in symbol PLS-6R) Цепь
- (in symbol STM32F103CBT6, part A) MCU
- (in symbol STM32F103CBT6, part B) MCU

### Library data of the parts
BQ1 = KX–327RT: Чип резонатор 32.768 кГц
BQ2 = Crystal_5032: Manufacturer: Diodes Incorporated; PartNumber: FY1000009; ValueManufacturerPartNumber: Crystal, 8MHz, 20pF, ±30ppm, case 5032, -40...+85°C; LoadCapacitance: 20pF; Tolerance: ±30ppm; Package: case 5032; HelpURL: https://www.digikey.com/product-detail/en/diodes-incorporated/FY1000009/FY1000009CT-ND/6043911; Temperature: -40...+85°C; TypeOscilator: Crystal; Supplier 1: Avnet; Supplier Part Number 1: ABM3B-8.000MHZ-B2-T
C4-C6 C9 C10 C12 C13 C18-C21 = CC0603-X5R-#-20%-10В: Чип конденсатор керамический; Компэл: CC0603KRX5R6BB475; Supplier 1: Digi-Key; Supplier Part Number 1: 311-1455-2-ND
C14-C17 = CT-10V-#-±20%-C: Чип конденсатор  танталовый; PartNumber: 593D226X9016C2TE3
DD1 = STM32F103CBT6: Medium-density performance line ARM®-based 32-bit MCU with 64 / or 128 KB Flash, USB, CAN, 7 timers, 2 ADCs, 9 com. interfaces; ComponentLink1Description: Datasheet; ComponentLink1URL: https://www.st.com/resource/en/datasheet/stm32f103c8.pdf
HA1 = HCM1203X: Пьезокерамический излучатель звука
HL1 = FYLS-0603UGC: Светодиод зеленый SMD0603
HL2-HL4 = FYLS-0603UYC: Светодиод желтый SMD0603
HL5 = FYLS-0603URC: Светодиод красный SMD0603
L2 L4 = BLM18: Чип индуктивность подавления EMP; VALUE: 600 Ом; Supplier 1: Mouser; Supplier Part Number 1: 81-BLM18PG331SN1D
R6-R11 R13 R17 R21 R24-R29 R32 R34 = CR0603-#-±5%: Чип резистор
XP5 = PLS-6R: Штыри на плату однорядные угловые

## Sheet isoRS485_block.SchDoc
size 420 x 297 mm; DocumentNumber: ЛАЭ3.20.10.02.05.200 Э3; SheetNumber: 5
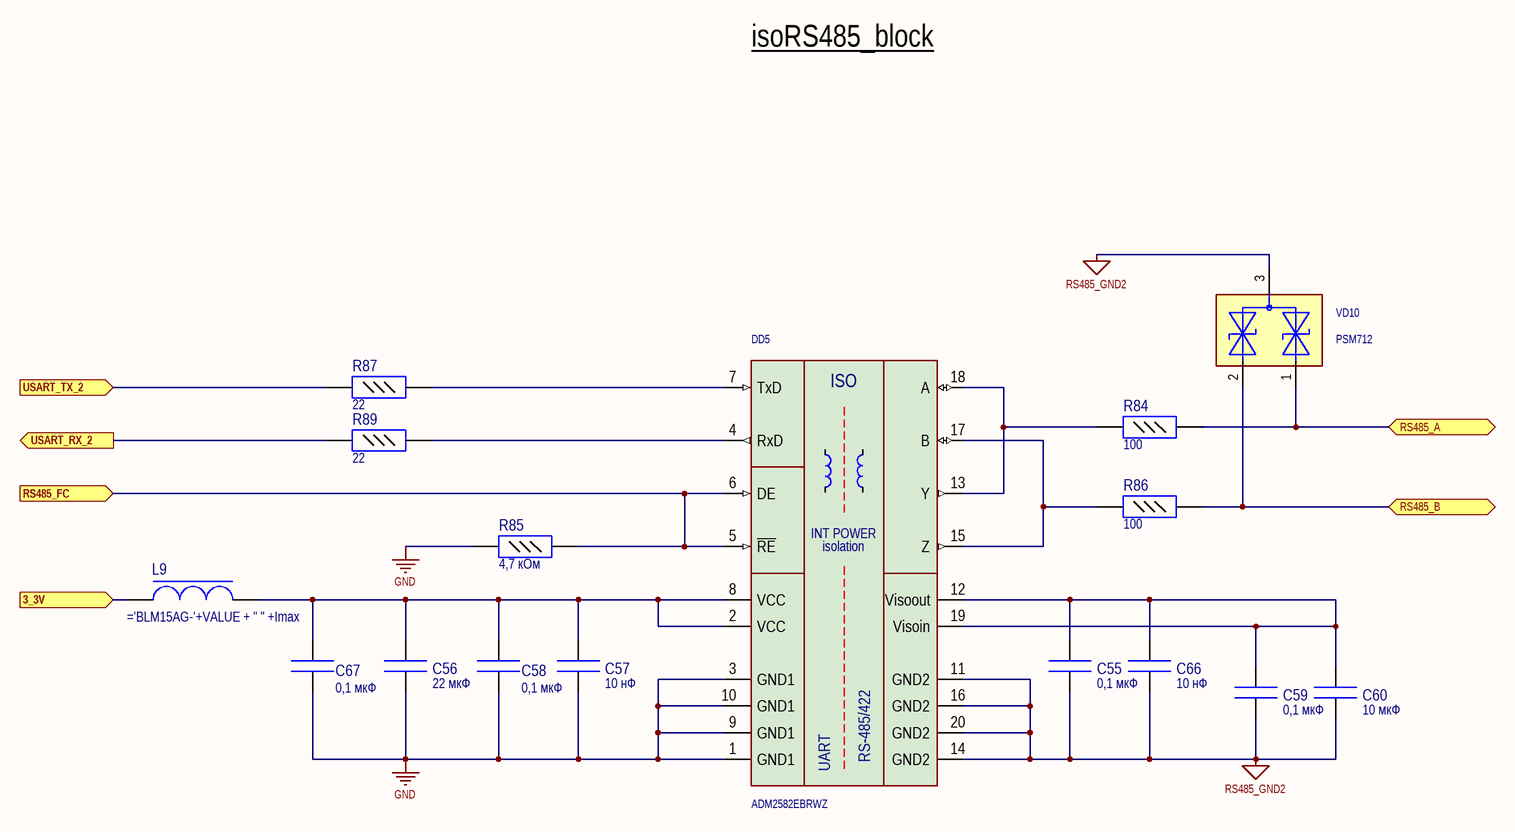
[diagram p4: isoRS485_block.SchDoc]

### Parts
C55  value 0,1 мкФ  [CC0402(1005)]  (hidden comment: CC0402-X7R-0,1 мкФ-20%-50В)
C56  value 22 мкФ  [CC1206]  (hidden comment: CC1206-X7R-22 мкФ-20%-50В)
C57  value 10 нФ  [CC0402(1005)]  (hidden comment: CC0402-X7R-10 нФ-20%-50В)
C58  value 0,1 мкФ  [CC0402(1005)]  (hidden comment: CC0402-X7R-0,1 мкФ-20%-50В)
C59  value 0,1 мкФ  [CC0402(1005)]  (hidden comment: CC0402-X7R-0,1 мкФ-20%-50В)
C60  value 10 мкФ  [CC0603]  (hidden comment: CC0603-X7R-10 мкФ-20%-50В)
C66  value 10 нФ  [CC0402(1005)]  (hidden comment: CC0402-X7R-10 нФ-20%-50В)
C67  value 0,1 мкФ  [CC0402(1005)]  (hidden comment: CC0402-X7R-0,1 мкФ-20%-50В)
DD5  ADM2582EBRWZ  [SOIC-W-20]
L9  (no value)  [CL0402(1005)]
R84  value 100  [CR0603]  (hidden comment: CR0603-100-±5%)
R85  value 4,7 кОм  [CR0603]  (hidden comment: CR0603-4,7 кОм-±5%)
R86  value 100  [CR0603]  (hidden comment: CR0603-100-±5%)
R87  value 22  [CR0603]  (hidden comment: CR0603-22-±5%)
R89  value 22  [CR0603]  (hidden comment: CR0603-22-±5%)
VD10  PSM712  [SOT-23]

### Ports
3_3V (in), RS485_A (bidir), RS485_B (bidir), RS485_FC (in), USART_RX_2 (out), USART_TX_2 (in)

### Nets
3_3V: L9.1 ; port 3_3V
GND: C56.2(-) C57.1(+) C58.1(+) C67.1(+) DD5.1(GND1) DD5.3(GND1) DD5.9(GND1) DD5.10(GND1) R85.2(-)
RS485_GND2: C55.2(-) C59.2(-) C60.2(-) C66.2(-) DD5.11(GND2) DD5.14(GND2) DD5.16(GND2) DD5.20(GND2) VD10.3
MCU_USART2_RX: R89.1(+) ; port USART_RX_2
MCU_USART2_TX: R87.1(+) ; port USART_TX_2
RS485_A: R84.2(-) VD10.1 ; port RS485_A
RS485_B: R86.2(-) VD10.2 ; port RS485_B
RS485_FC: DD5.5(~{RE}) DD5.6(DE) R85.1(+) ; port RS485_FC
NetC55_1: C55.1(+) C59.1(+) C60.1(+) C66.1(+) DD5.12(Visoout) DD5.19(Visoin)
NetC56_1: C56.1(+) C57.2(-) C58.2(-) C67.2(-) DD5.2(VCC) DD5.8(VCC) L9.2
NetDD5_4: DD5.4(RxD) R89.2(-)
NetDD5_7: DD5.7(TxD) R87.2(-)
NetDD5_13: DD5.13(Y) DD5.18(A) R84.1(+)
NetDD5_15: DD5.15(Z) DD5.17(B) R86.1(+)

### Notes on the sheet
- isoRS485_block
- Подп. и дата
- Инв. № дубл.
- Взам. инв. №
- Инв. № подл.
- Изм.
- Лист
- № докум.
- Подп.
- Дата
- 2.106-A3
- Копировал
- Формат А3
- (in symbol ADM2582E) ISO; INT POWER; isolation; RS-485/422; UART

### Library data of the parts
C55 C57-C59 C66 C67 = CC0402-X7R-#-20%-50В: Чип конденсатор керамический; Supplier 1: Digi-Key; Supplier Part Number 1: 399-3066-1-ND
C56 = CC1206-X7R-#-20%-50В: Чип конденсатор керамический
C60 = CC0603-X7R-#-20%-50В: as C79 on sheet POWER; Supplier 1: Newark; Supplier Part Number 1: 65R8251
DD5 = ADM2582E: Isolated RS-485/RS-422 transceiver, configurable as half or full duplex isoPower® integrated isolated dc-to-dc converter; Manufacturer: Anallog Devices; Data Rate: 16 Mbps; Voltage: 3.3 V or 5 V; PartNumber: ADM2582EBRWZ; Temperature: -40...+85 °C; Supplier 1: Mouser; Supplier Part Number 1: 584-ADM2582EBRWZ
L9 = BLM15: Чип индуктивность подавления EMP; VALUE: 600 Ом; Компэл: BLM15AG601SN1D; Imax: 300 mA; Supplier 1: Farnell; Supplier Part Number 1: 1515762
R84-R87 R89 = CR0603-#-±5%: Чип резистор
VD10 = PSM712: ESD RS-485; Supplier 1: Octopart; Supplier Part Number 1: GreenTree Electronics - PSM712-LF-T7

## Sheet MOSFET_drivers.SchDoc
size 420 x 297 mm; DocumentNumber: ЛАЭ3.20.10.02.05.200 Э3; SheetNumber: 6
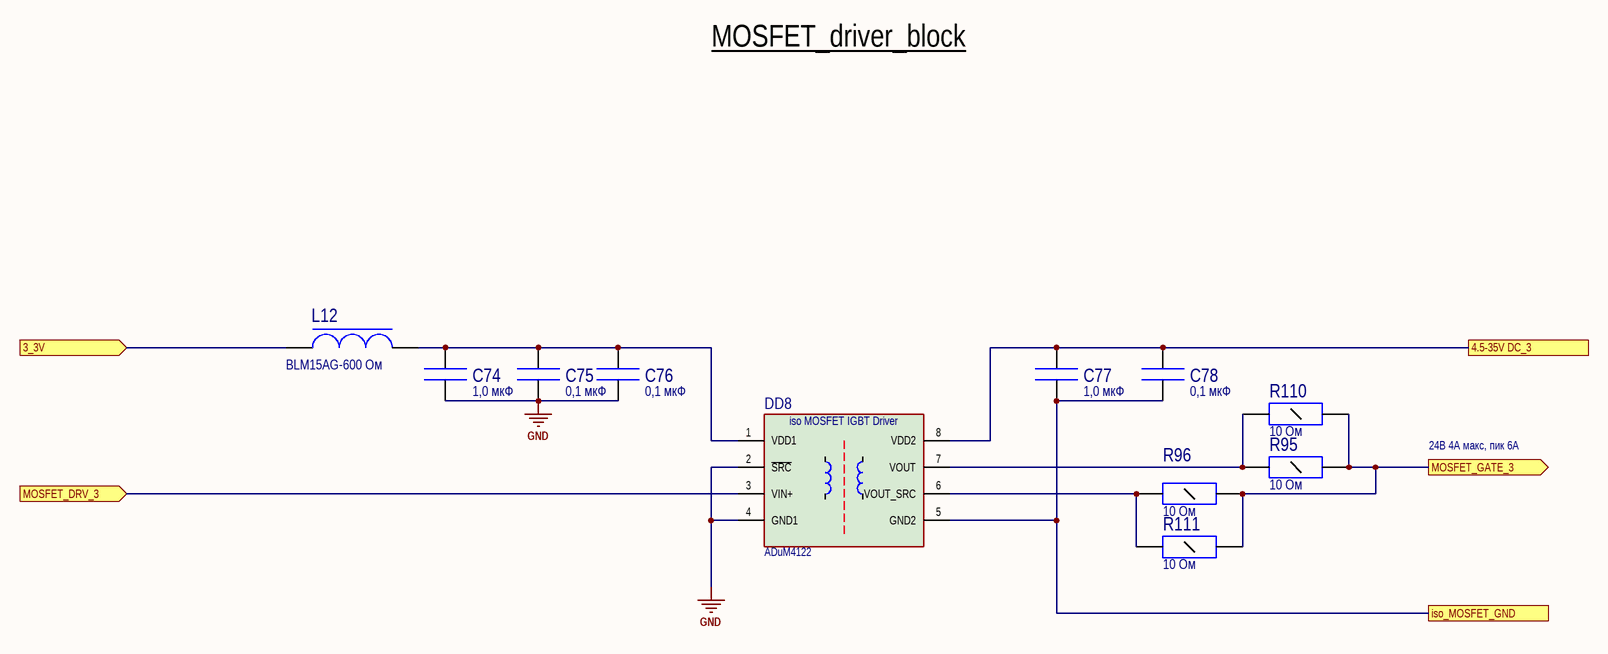
[diagram p5: MOSFET_drivers.SchDoc]

### Parts
C74  value 1,0 мкФ  [CC1206]  (hidden comment: CC1206-X7R-1,0 мкФ-20%-50В)
C75  value 0,1 мкФ  [CC0603]  (hidden comment: CC0603-X7R-0,1 мкФ-20%-50В)
C76  value 0,1 мкФ  [CC0603]  (hidden comment: CC0603-X7R-0,1 мкФ-20%-50В)
C77  value 1,0 мкФ  [CC1206]  (hidden comment: CC1206-X7R-1,0 мкФ-20%-50В)
C78  value 0,1 мкФ  [CC0603]  (hidden comment: CC0603-X7R-0,1 мкФ-20%-50В)
DD8  ADuM4122  [SOIC127P1031X265-8N]
L12  BLM15AG-600 Ом  [CL0402(1005)]
R95  value 10 Ом  [CR1206]  (hidden comment: CR1206-10 Ом-±5%)
R96  value 10 Ом  [CR1206]  (hidden comment: CR1206-10 Ом-±5%)
R110  value 10 Ом  [CR1206]  (hidden comment: CR1206-10 Ом-±5%)
R111  value 10 Ом  [CR1206]  (hidden comment: CR1206-10 Ом-±5%)

### Ports
3_3V (in), 4.5-35V DC_3, iso_MOSFET_GND, MOSFET_DRV_3 (in), MOSFET_GATE_3 (out)

### Nets
3_3V: L12.1 ; port 3_3V
GND: C74.2(-) C75.1(+) C76.1(+) DD8.2(~{SRC}) DD8.4(GND1)
+24V_IN: C77.1(+) C78.2(-) DD8.8(VDD2) ; port 4.5-35V DC_3
-24V_IN: C77.2(-) C78.1(+) DD8.5(GND2) ; port iso_MOSFET_GND
MOSFET_3: DD8.3(VIN+) ; port MOSFET_DRV_3
MOSFET_GATE_3: R95.2(-) R96.2(-) R110.2(-) R111.2(-) ; port MOSFET_GATE_3
NetC74_1: C74.1(+) C75.2(-) C76.2(-) DD8.1(VDD1) L12.2
NetDD8_6: DD8.6(VOUT_SRC) R96.1(+) R111.1(+)
NetDD8_7: DD8.7(VOUT) R95.1(+) R110.1(+)

### Notes on the sheet
- MOSFET_driver_block
- 24В 4А макс, пик 6А
- Подп. и дата
- Инв. № дубл.
- Взам. инв. №
- Инв. № подл.
- Изм.
- Лист
- № докум.
- Подп.
- Дата
- 2.106-A3
- Копировал
- Формат А3
- (in symbol ADuM4122ARIZ) iso MOSFET IGBT Driver

### Library data of the parts
C74 C77 = CC1206-X7R-#-20%-50В: Чип конденсатор керамический
C75 C76 C78 = CC0603-X7R-#-20%-50В: as C79 on sheet POWER; Supplier 1: Newark; Supplier Part Number 1: 65R8251
DD8 = ADuM4122ARIZ: Single Gate, Adjustable Slew Rate, Isolated Gate Driver, 3 A Short-Circuit (<3Ω); ComponentLink1Description: Datasheet; ComponentLink1URL: https://www.analog.com/media/en/technical-documentation/data-sheets/ADuM4122.pdf
L12 = BLM15: as L1 on sheet isoSPI_block; Supplier 1: Farnell; Supplier Part Number 1: 1515762
R95 R96 R110 R111 = CR1206-#-±5%: Чип резистор; Supplier 1: Mouser; Supplier Part Number 1: 652-CR1206JW-361ELF

## Sheet Analog_IN_block.SchDoc
size 420 x 297 mm; DocumentNumber: ЛАЭ3.20.10.02.05.200 Э3; SheetNumber: 7
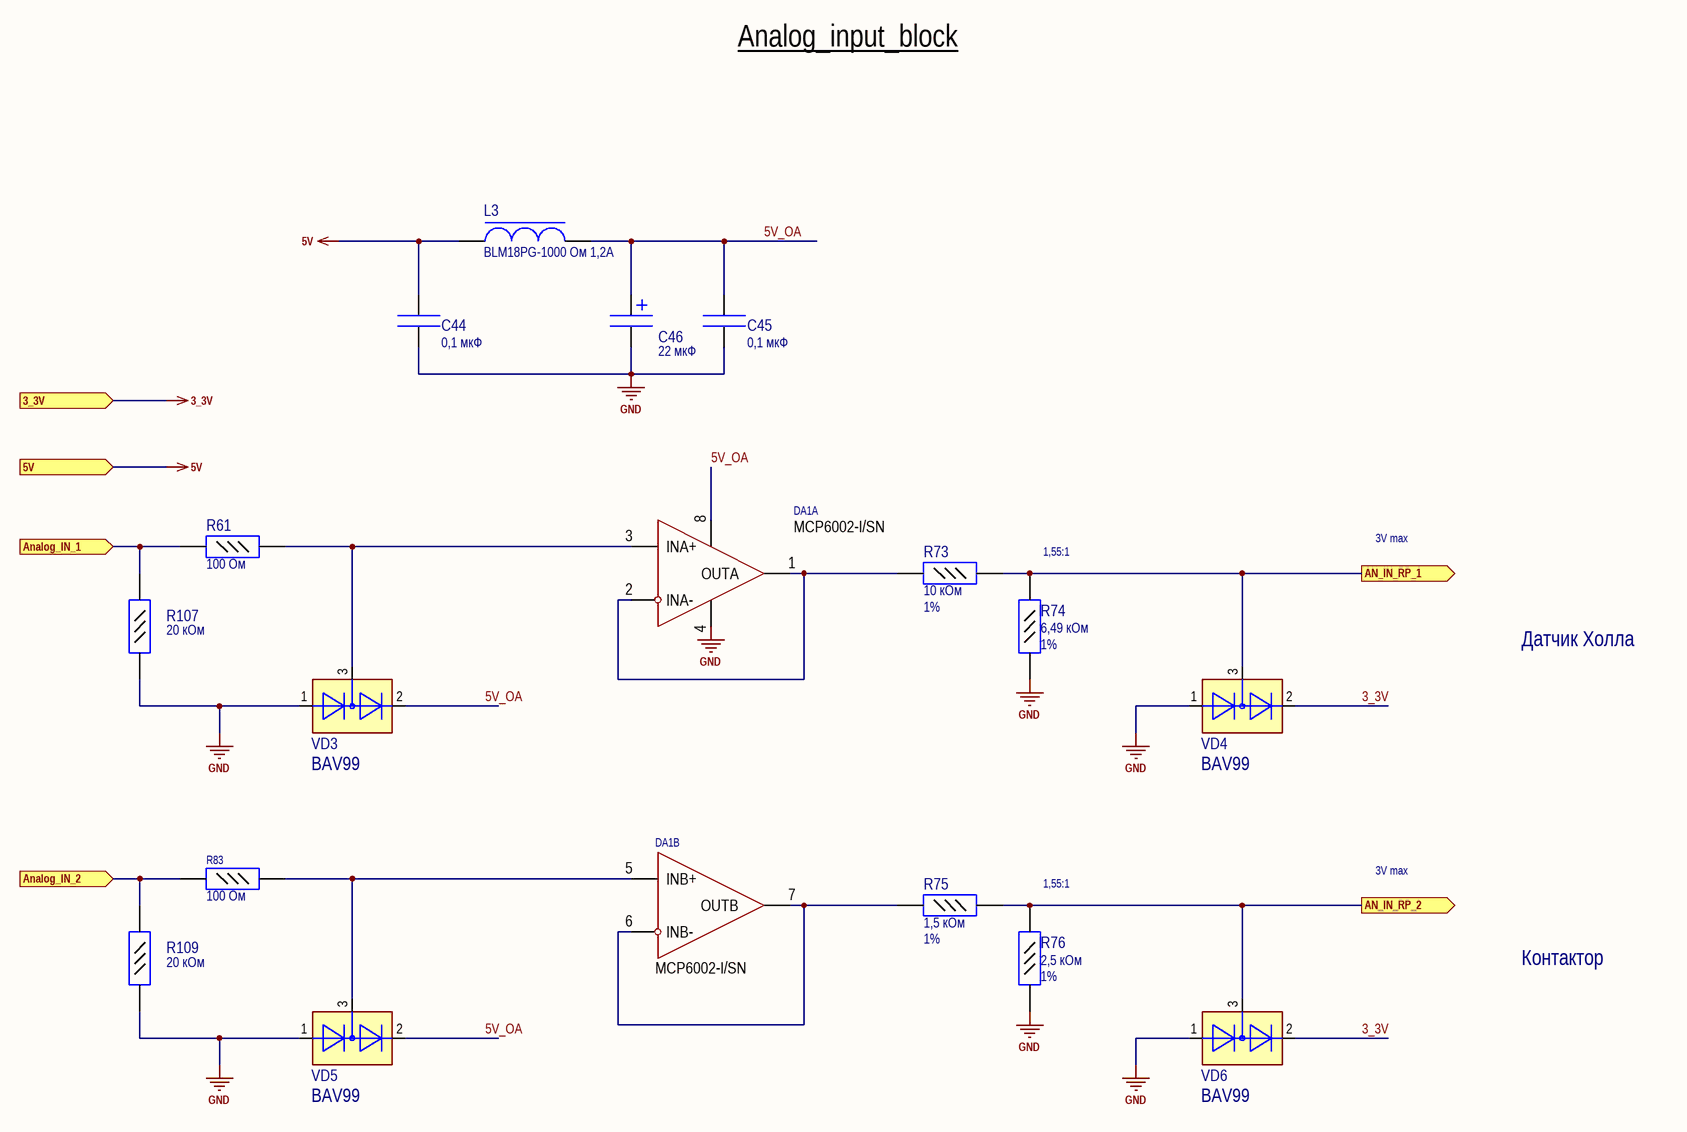
[diagram p6: Analog_IN_block.SchDoc]

### Parts
C44  value 0,1 мкФ  [CC0603]  (hidden comment: CC0603-X7R-0,1 мкФ-20%-50В)
C45  value 0,1 мкФ  [CC0603]  (hidden comment: CC0603-X7R-0,1 мкФ-20%-50В)
C46  value 22 мкФ  [CT-D]  (hidden comment: CT-35V-22мкФ-±20%-D)
DA1  MCP6002-I/SN  [8-SOIC]  (parts A,B of 2)
L3  BLM18PG-1000 Ом 1,2A  [CL0603]
R61  value 100 Ом  [CR0603]  (hidden comment: CR0603-100 Ом-±5%)
R73  value 10 кОм  TOLERANCE: 1%  [CR0603]  (hidden comment: CR0603-10 кОм-±1%)
R74  value 6,49 кОм  TOLERANCE: 1%  [CR0603]  (hidden comment: CR0603-6,49 кОм-±1%)
R75  value 1,5 кОм  TOLERANCE: 1%  [CR0603]  (hidden comment: CR0603-1,5 кОм-±1%)
R76  value 2,5 кОм  TOLERANCE: 1%  [CR0603]  (hidden comment: CR0603-2,5 кОм-±1%)
R83  value 100 Ом  [CR0603]  (hidden comment: CR0603-100 Ом-±5%)
R107  value 20 кОм  [CR0603]  (hidden comment: CR0603-20 кОм-±5%)
R109  value 20 кОм  [CR0603]  (hidden comment: CR0603-20 кОм-±5%)
VD3  BAV99  [SOT-23]
VD4  BAV99  [SOT-23]
VD5  BAV99  [SOT-23]
VD6  BAV99  [SOT-23]

### Ports
3_3V (in), 5V (in), AN_IN_RP_1 (out), AN_IN_RP_2 (out), Analog_IN_1 (in), Analog_IN_2 (in)

### Nets
3_3V: VD4.2 VD6.2 ; port 3_3V
5V: C44.1(+) L3.1 ; port 5V
GND: C44.2(-) C45.2(-) C46.2(-) DA1.4(V-) R74.1(+) R76.1(+) R107.1(+) R109.1(+) VD3.1 VD4.1 VD5.1 VD6.1
5V_OA: C45.1(+) C46.1(+) DA1.8(V+) L3.2 VD3.2 VD5.2  [project net 5V_OA_7]
AN_IN_1: R73.2(-) R74.2(-) VD4.3 ; port AN_IN_RP_1
AN_IN_2: R75.2(-) R76.2(-) VD6.3 ; port AN_IN_RP_2
Analog_IN_1: R61.1(+) R107.2(-) ; port Analog_IN_1
Analog_IN_2: R83.1(+) R109.2(-) ; port Analog_IN_2
NetDA1_1: DA1.1(OUTA) DA1.2(INA-) R73.1(+)
NetDA1_3: DA1.3(INA+) R61.2(-) VD3.3
NetDA1_5: DA1.5(INB+) R83.2(-) VD5.3
NetDA1_6: DA1.6(INB-) DA1.7(OUTB) R75.1(+)

### Notes on the sheet
- Analog_input_block
- (near R74) 1,55:1
- 3V max
- Датчик Холла
- (near R76) 1,55:1
- Контактор
- Подп. и дата
- Инв. № дубл.
- Взам. инв. №
- Инв. № подл.
- Изм.
- Лист
- № докум.
- Подп.
- Дата
- 2.106-A3
- Копировал
- Формат А3

### Library data of the parts
C44 C45 = CC0603-X7R-#-20%-50В: as C79 on sheet POWER; Supplier 1: Newark; Supplier Part Number 1: 65R8251
C46 = CT-35V-#-±20%-D: Чип конденсатор  танталовый
DA1 = MCP6002-I/SN: Manufacturer: Microchip; ValueManufacturerPartNumber: IC op amplifier, Rail-to-Rail, 1 MHz, 1.8...6.0V, -40...+85°C, SO-8; Supply: 1.8...6.0V; OutputType: Rail-to-Rail; GainBandwidth: 1 MHz; Package: SO-8; ComponentType: IC op amplifier; Temperature: -40...+85°C; Supplier 1: RSComponents; Supplier Part Number 1: 6283598; PartNumber: MCP6002-I/SN
L3 = BLM18: Чип индуктивность подавления EMP; VALUE: 1000 Ом; Imax: 1,2A; Supplier 1: Mouser; Supplier Part Number 1: 81-BLM18PG331SN1D
R61 R83 R107 R109 = CR0603-#-±5%: Чип резистор
R73-R76 = CR0603-#-±1%: Чип резистор; Supplier 1: Farnell; Supplier Part Number 1: 2008332
VD3-VD6 = BAV99: Диоды; Supplier 1: Digi-Key; Supplier Part Number 1: BAV99-FDICT-ND

## Nets that join several sheets
3_3V: isoSPI_block (L1.1), POWER (7 pins), MCU_block (L4.1 R10.2 XP5.5), isoRS485_block (L9.1), MOSFET_drivers (L12.1), Analog_IN_block (VD4.2 VD6.2)
5V: Main (XP1.3 XP3.4), POWER (C82.1 DA2.14 L13.1), Analog_IN_block (C44.1 L3.1)
GND: Main (XP1.2), isoSPI_block (5 pins), POWER (23 pins), MCU_block (30 pins), isoRS485_block (9 pins), MOSFET_drivers (5 pins), Analog_IN_block (12 pins)
3_3V_GOOD: POWER (DA9.6 R97.2), MCU_block (DD1.29)
+24V_IN: Main (XP4.1 XP4.5), POWER (FP1.1), MOSFET_drivers (C77.1 C78.2 DD8.8)
-24V_IN: Main (XP3.2 XP4.4 XP4.8), POWER (DA2.2 DA2.3 J2.2), MOSFET_drivers (C77.2 C78.1 DD8.5)
AN_IN_1: MCU_block (DD1.10), Analog_IN_block (R73.2 R74.2 VD4.3)
AN_IN_2: MCU_block (DD1.11), Analog_IN_block (R75.2 R76.2 VD6.3)
Analog_IN_1: Main (XP1.1), Analog_IN_block (R61.1 R107.2)
Analog_IN_2: Main (XP3.3), Analog_IN_block (R83.1 R109.2)
~{CS}_SPI_Mon: isoSPI_block (DD2.5), MCU_block (R24.2)
I_N: Main (T1.14), isoSPI_block (DD2.11 R39.1)
I_P: Main (T1.16), isoSPI_block (DD2.10 R39.2)
MCU_USART2_RX: MCU_block (DD1.13), isoRS485_block (R89.1)
MCU_USART2_TX: MCU_block (DD1.12), isoRS485_block (R87.1)
MISO_SPI_Mon: isoSPI_block (DD2.3 R41.1), MCU_block (R27.2)
MOSFET_3: MCU_block (R17.2), MOSFET_drivers (DD8.3)
MOSFET_GATE_3: Main (XP3.1), MOSFET_drivers (R95.2 R96.2 R110.2 R111.2)
MOSI_SPI_Mon: isoSPI_block (DD2.2), MCU_block (R29.2)
RS485_A: Main (XP4.6), isoRS485_block (R84.2 VD10.1)
RS485_B: Main (XP4.7), isoRS485_block (R86.2 VD10.2)
RS485_FC: MCU_block (R21.2), isoRS485_block (DD5.5 DD5.6 R85.1)
SCK_SPI_Mon: isoSPI_block (DD2.4), MCU_block (R26.2)